# Altium schematic sheet Shutdown_2019_v1.1_RTDS.SchDoc: Shutdown_2019_v1.1
size 453 x 301 mm; Date: 1/4/2019 10:42:27 PM; SheetNumber: 10; GateName_1: G$1; SymbolName_1: FRAME_B_L; LibraryName: frames; DeviceSetName: FRAME_B_L; GateName_2: G$2; SymbolName_2: DOCFIELD
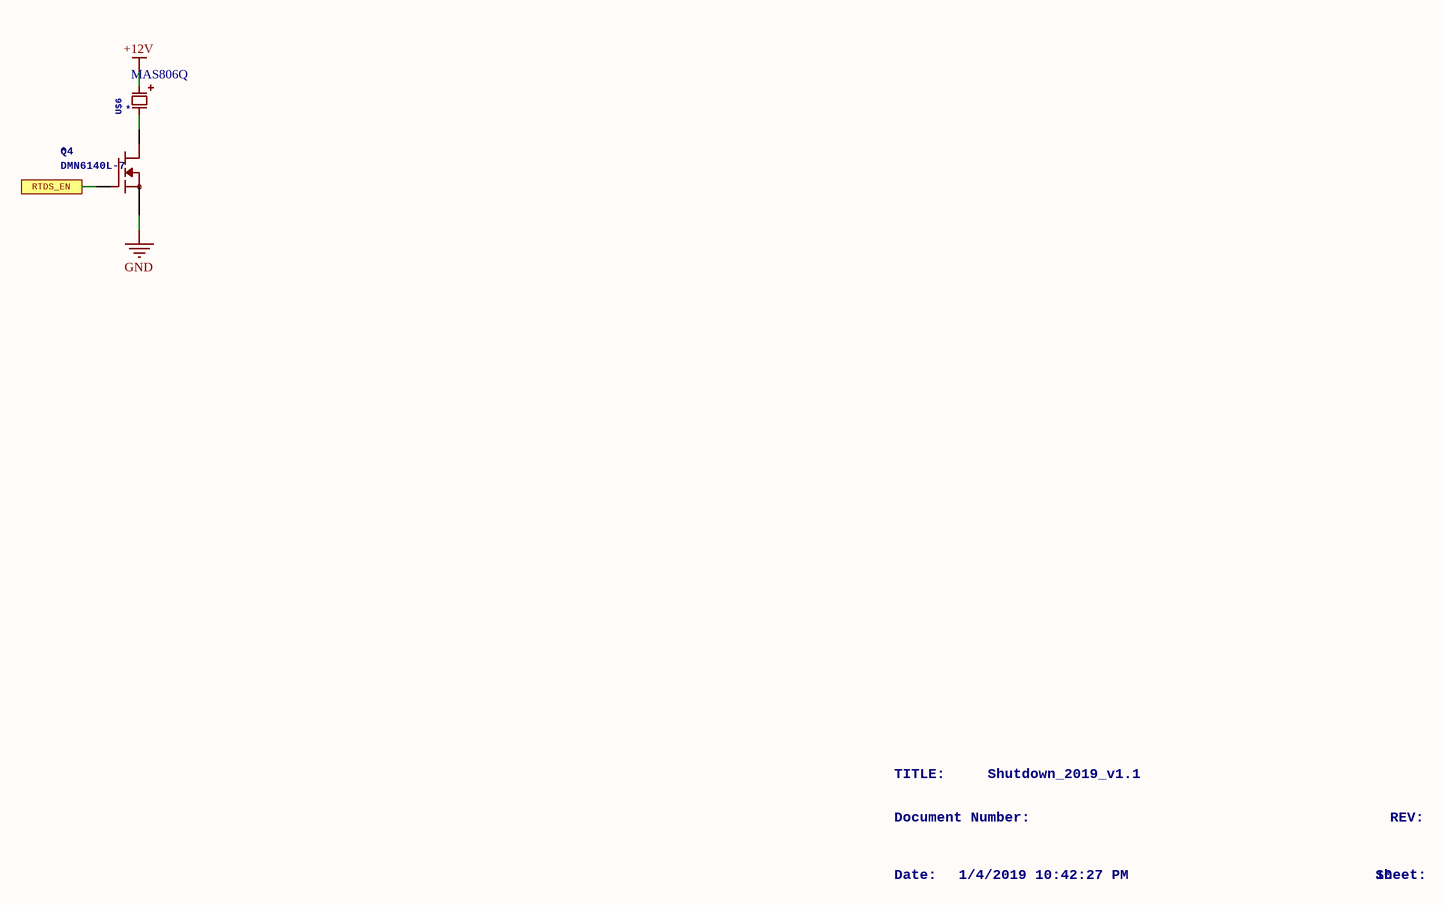
[diagram p0: Shutdown_2019_v1.1_RTDS.SchDoc]

## Parts
Q4  DMN6140L-7  [SOT23]
U$6  MAS806Q  [MAS806Q]

## Ports
RTDS_EN

## Nets
+12V: U$6.POS(A)
GND: Q4.2(S)
RTDS_EN: Q4.1(G) ; port RTDS_EN
NetQ4_3: Q4.3(D) U$6.NEG(B)

## Notes on the sheet
- TITLE:
- Document Number:
- Shutdown_2019_v1.1
- REV:
- Date:
- 1/4/2019 10:42:27 PM
- Sheet:
- 10
- 1
- 2
- 3
- 4
- 5
- 6
- 7
- 8
- 9
- A
- B
- C
- D
- E
- F

## Library data of the parts
Q4 = DMN6140L-7: DMN6140L-7 Vgs(th) = 3V, Rds(on) = 140mOhm, Vds(max) = 60V; GateName_1: G$1; SymbolName_1: N-MOSFET-GDS; LibraryName: TRANS; DeviceSetName: DMN6140L-7; NAME: *
U$6 = MAS806Q: Mallory MAS806Q  PiezoElectric Buzzer  6-14V -- 103dB -- 50mA buzzerDatasheet; GateName_1: G$1; SymbolName_1: PIEZOELECTRIC; LibraryName: MALLORY; DeviceSetName: MAS806Q; NAME: *